# EAGLE design blink1mk2_v2d5_usbpcb (EAGLE 8.6.0)
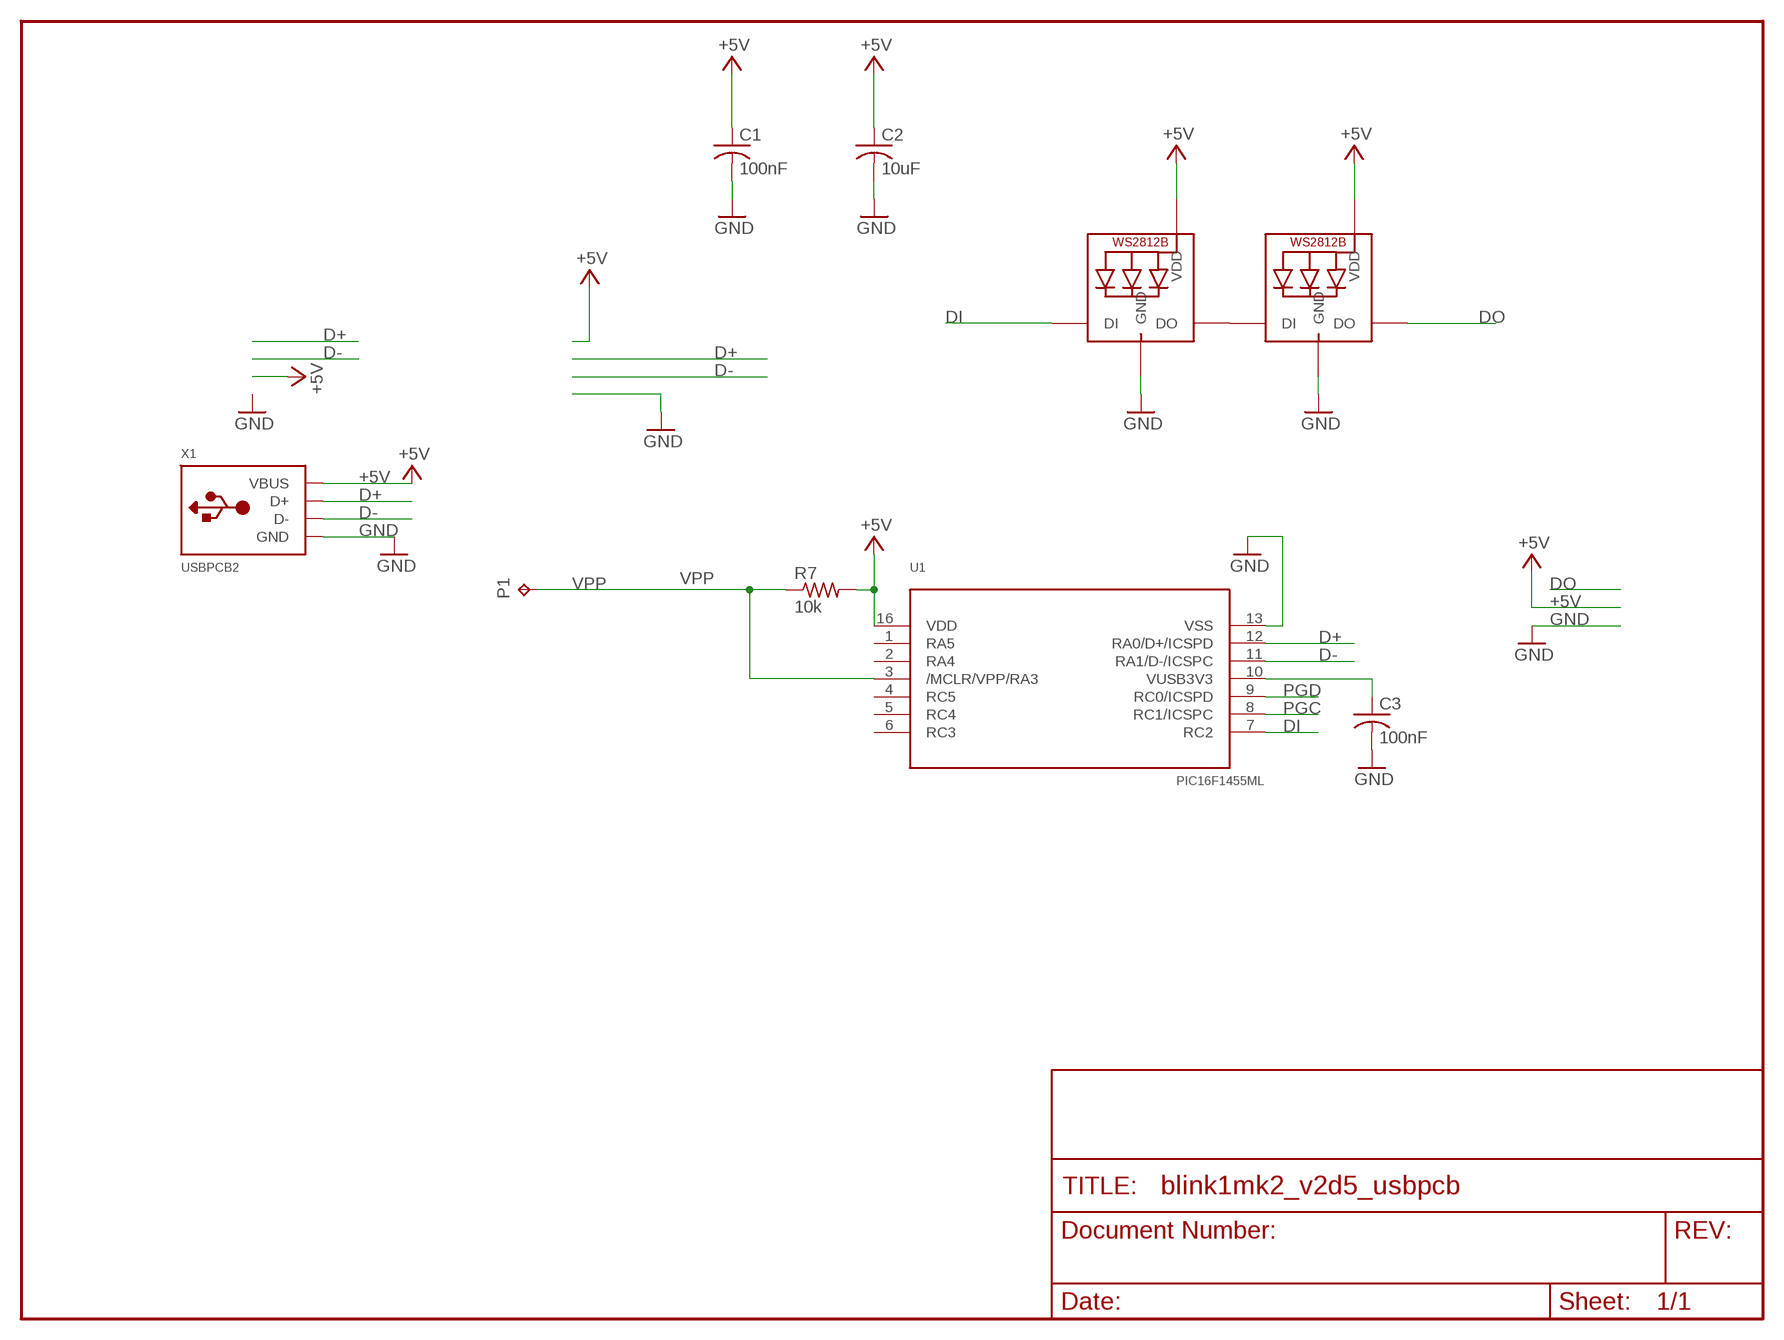
[diagram p0: schematic, sheet 1]

## Parts
C1  100nF  C-USC0402  [C0402]
C2  10uF  C-USC0402  [C0402]
C3  100nF  C-USC0402  [C0402]
LED1  WS2812B4020SIDE  [SK6812-SIDE]
LED2  WS2812B4020SIDE  [SK6812-SIDE]
P1  TPTP11SQ  [TP11SQ]
R7  10k  R-US_R0402  [R0402]
U1  PIC16F1455ML  [QFN16_4X4]
X1  USBPCB2  [USB-A-PCB-2]

## Nets
+5V: C1.1 C2.1 LED1.1-VDD(VDD) LED2.1-VDD(VDD) R7.2 U1.16(VDD) X1.5V(VBUS)
D+: U1.12(RA0/D+/ICSPD) X1.USB_P(D+)
D-: U1.11(RA1/D-/ICSPC) X1.USB_M(D-)
DI: LED1.4-DIN(DI) U1.7(RC2)
DO: LED2.2-DOUT(DO)
GND: C1.2 C2.2 C3.2 LED1.3-GND(GND) LED2.3-GND(GND) U1.13(VSS) X1.GND
N$1: LED1.2-DOUT(DO) LED2.4-DIN(DI)
PGC: U1.8(RC1/ICSPC)
PGD: U1.9(RC0/ICSPD)
VPP: P1.TP R7.1 U1.3(/MCLR/VPP/RA3)
VUSB3V3: C3.1 U1.10(VUSB3V3)
Unconnected: U1.1(RA5) U1.2(RA4) U1.4(RC5) U1.5(RC4) U1.6(RC3)

## Library data of the parts
C1-C3 = rcl:C-US: CAPACITOR, American symbol; SPICEPREFIX: C
LED1 LED2 = todstuff:WS2812B
P1 = testpad:TP: Test pad
R7 = rcl:R-US_: RESISTOR, American symbol; SPICEPREFIX: R
U1 = todstuff:PIC16F1455
X1 = todstuff:USB

## Board
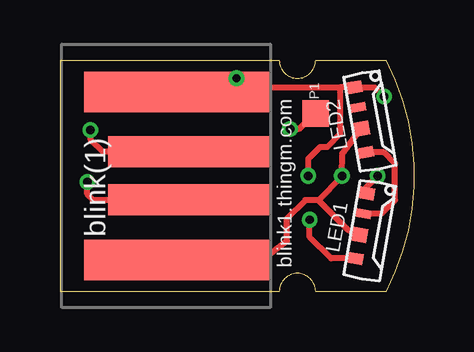
[diagram p1: board, top side]
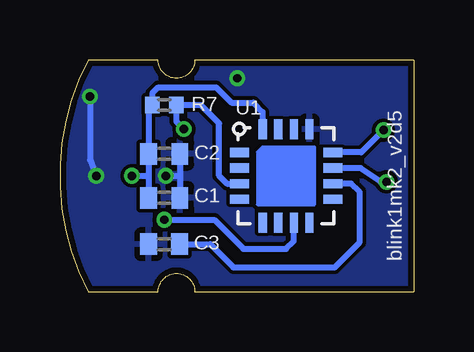
[diagram p2: board, bottom side, seen from below]

Size 14.77 x 9.65 mm. Coordinates in mm from the lower left corner, seen from the top.
Outline: 0,9.65 9.14,9.65 arc180 10.67,9.65 13.59,9.65 arc-55 13.59,0 10.67,0 arc180 9.14,0 0,0 0,9.65
Copper layers (1*16): Top 0.035mm / dielectric 1.5mm / Bottom 0.035mm
Design rules "SeeedStudio_2layer_DRU_no_angle_20140221": minimum track width 6mil, minimum drill 12mil, track to track 6mil, track to pad 6mil, pad to pad 6mil, via to via 6mil, smd to smd 0mil, copper to edge 10mil, drill to drill 10mil, minimum pad ring 10mil, minimum via ring 6mil, stop-mask expansion 2mil, vias tented up to drill 100mil, thermal gap 10mil

### Footprints (pad centres in the part's own frame; a part is rotated, then mirrored left to right if it is on the bottom)
C0402 = smd 0.7 x 0.9: 1 -0.65,0; 2 0.65,0
SK6812-SIDE = smd 0.6 x 0.7: 1-VDD 0.25,-0.45 | smd 0.35 x 0.7: 2-DOUT -0.65,-0.45 | smd 0.5 x 0.7: 3-GND -1.5,-0.45 | smd 0.45 x 0.7: 4-DIN 1.25,-0.45
TP11SQ = smd 1.1 x 1.1: TP 0,0
R0402 = smd 0.6 x 0.7: 1 -0.5,0; 2 0.5,0
QFN16_4X4 = smd 0.8 x 0.35: 1 -1.95,0.975; 2 -1.95,0.325; 3 -1.95,-0.325; 4 -1.95,-0.975; 9 1.95,-0.975; 10 1.95,-0.325; 11 1.95,0.325; 12 1.95,0.975 | smd 0.35 x 0.8: 5 -0.975,-1.95; 6 -0.325,-1.95; 7 0.325,-1.95; 8 0.975,-1.95; 13 0.975,1.95; 14 0.325,1.95; 15 -0.325,1.95; 16 -0.975,1.95
USB-A-PCB-2 = smd 7.75 x 1.69: 5V -1.47,-3.5; GND -1.47,3.5 | smd 6.75 x 1.3: USB_M -0.97,-1; USB_P -0.97,1

### Placement (x,y rotation side)
C1  10.41,3.91 0 bottom
C2  10.41,5.74 0 bottom
C3  10.42,1.98 180 bottom
LED1  12.95,2.54 260 top
LED2  12.95,7.11 280 top
P1  10.67,7.42 0 top
R7  10.41,7.77 180 bottom
U1  5.33,4.83 0 bottom
X1  6.35,4.83 0 top

### Tracks (layer width: path | path; a pad name or v marks a point on that pad's centre or on a via)
+5V  (via drill 0.35)
  Top 0.254: 8.38,1.78 7.93,1.33 X1.5V 8.44,1.33 9.48,2.11 9.48,3.06 10.23,3.81 10.78,3.81 | LED2.1-VDD 11.77,5.75 v11.76,4.83 11.76,4.8 10.78,3.81 | 10.78,3.81 12.03,2.56 LED1.1-VDD
  Bottom 0.254: U1.16 6.31,7.48 6.7,7.87 7.62,7.87 8.26,8.51 10.66,8.51 10.91,8.26 R7.2 11.06,7.62 C2.1 11.06,4.83 | v11.76,4.83 11.06,4.83 | 11.06,4.83 C1.1
D+  (via drill 0.35)
  Top 0.254: 1.4,6.6 v1.27,6.73 1.27,6.35 1.79,5.83 X1.USB_P
  Bottom 0.254: v1.27,6.73 2.2,5.8 U1.12
D-  (via drill 0.35)
  Top 0.254: 2.79,3.82 2.29,3.81 1.4,3.81 1.14,4.06 v1.14,4.57 | 2.79,3.82 3.32,3.83 | X1.USB_M 2.79,3.83 2.79,3.82
  Bottom 0.254: v1.14,4.57 1.4,4.57 2.23,5.15 U1.11
DI  (via drill 0.35)
  Top 0.254: v10.41,2.99 10.41,2.29 11.31,1.39 12.55,1.39 | 12.55,1.39 LED1.4-DIN | LED1.4-DIN 12.55,1.39 | LED1.4-DIN 12.55,1.37 12.55,1.39
  Bottom 0.254: U1.7 5.01,2.1 5.33,1.78 7.11,1.78 8.33,2.99 v10.41,2.99
GND  (via drill 0.35)
  Top 0.254: v13.52,8.13 13.13,8.51 LED2.3-GND 11.68,8.51 | 11.68,8.51 11.62,8.51 8.71,8.51 8.58,8.64 8.64,8.64 8.33,8.33 X1.GND 7.37,8.33 v7.37,8.89 | 11.68,8.51 11.68,6.56 11.15,6.03 10.85,6.03 10.35,5.52 v10.35,4.83 | LED1.3-GND 12.77,4.34 v13.25,4.83
  Bottom 0.254: C2.2 9.76,4.83 | 9.76,4.83 C1.2 | v10.35,4.83 9.76,4.83 | v13.52,8.13 13.52,5.49 v13.25,4.83
  pour Bottom: 14.99,10.67 14.99,-0.25 0,-0.25 0,10.67
N$1
  Top 0.254: LED2.4-DIN 13.5,5.8 13.97,5.33 13.97,3.81 13.42,3.26 LED1.2-DOUT
VPP  (via drill 0.35)
  Top 0.254: P1.TP 10.61,7.42 9.97,6.77 v9.6,6.77
  Bottom 0.254: 9.68,6.77 v9.6,6.77 9.91,7.09 R7.1 8.89,7.77 8.13,7.01 8.13,4.83 7.8,4.5 U1.3
VUSB3V3
  Bottom 0.254: U1.10 2.61,4.5 2.29,4.18 2.29,2.03 3.3,1.02 7.53,1.02 8.49,1.98 C3.1

### Text on the board
tPlace: blink(1) | blink1.thingm.com
bPlace: blink1mk2_v2d5